# EAGLE design 25PinConnector (EAGLE 9.6.2)
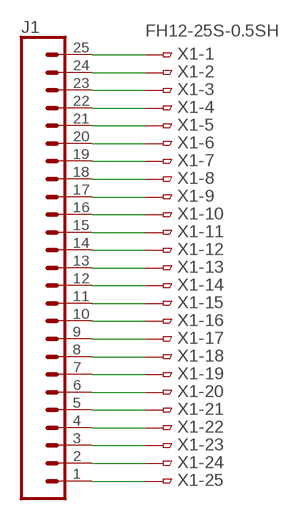
[diagram p0: schematic, sheet 1]

## Parts
J1  CONN_25  [1X25]
X1  FH12-25S-0.5SH  [FH12-25S-0.5SH]

## Nets
N$1: J1.25 X1.1
N$2: J1.24 X1.2
N$3: J1.23 X1.3
N$4: J1.22 X1.4
N$5: J1.21 X1.5
N$6: J1.20 X1.6
N$7: J1.19 X1.7
N$8: J1.18 X1.8
N$9: J1.17 X1.9
N$10: J1.16 X1.10
N$11: J1.15 X1.11
N$12: J1.14 X1.12
N$13: J1.13 X1.13
N$14: J1.12 X1.14
N$15: J1.11 X1.15
N$16: J1.10 X1.16
N$17: J1.9 X1.17
N$18: J1.8 X1.18
N$19: J1.7 X1.19
N$20: J1.6 X1.20
N$21: J1.5 X1.21
N$22: J1.4 X1.22
N$23: J1.3 X1.23
N$24: J1.2 X1.24
N$25: J1.1 X1.25

## Library data of the parts
J1 = SparkFun-Connectors:CONN_25: Multi connection point. Often used as Generic Header-pin footprint for 0.1 inch spaced/style header connections On any of the 0.1 inch spaced packages, you can populate with these: Break Away Headers - Straight <https://www.sparkfun.com/products/116> (PRT-00116) Break Away Male Headers - Right Angle <https://www.sparkfun.com/products/553> (PRT-00553) Female Headers <https://www.sparkfun.com/products/115> (PRT-00115) Break Away Headers - Machine Pin <https://www.sparkfun.com/products/117> (PRT-00117) Break Away Female Headers - Swiss Machine Pin <https://www.sparkfun.com/products/743> (PRT-00743) For SCREWTERMINALS and SPRING TERMINALS visit here: Screw Terimnals on SparkFun.com <https://www.sparkfun.com/search/results?term=Screw+Terminals> (5mm/3.5mm/2.54mm spacing) This device is also useful as a general connection point to wire up your design to another part of your project. Our various solder wires solder well into these plated through hole pads. Hook-Up Wire - Assortment (Stranded, 22 AWG) <https://www.sparkfun.com/products/11375> (PRT-11375) Hook-Up Wire - Assortment (Solid Core, 22 AWG) <https://www.sparkfun.com/products/11367> (PRT-11367) View the entire wire category on our website here <https://www.sparkfun.com/categories/141> Special notes: Molex polarized connector foot print use with SKU : PRT-08231 with associated crimp pins and housings. 1MM SMD Version SKU: PRT-10208 NOTES ON THE VARIANTS LOCK and LOCK_LONGPADS... This footprint was designed to help hold the alignment of a through-hole component (i.e. 6-pin header) while soldering it into place. You may notice that each hole has been shifted either up or down by 0.005 of an inch from it's more standard position (which is a perfectly straight line). This slight alteration caused the pins (the squares in the middle) to touch the edges of the holes. Because they are alternating, it causes a "brace" to hold the component in place. 0.005 has proven to be the perfect amount of "off-center" position when using our standard breakaway headers. Although looks a little odd when you look at the bare footprint, once you have a header in there, the alteration is very hard to notice. Also,if you push a header all the way into place, it is covered up entirely on the bottom side.
X1 = con-hirose:FH12-25S-0.5S: 0.5mm Pitch Connectors For FPC/FFC Source: Data sheet <http://www.hirose.co.jp/cataloge_hp/e58605370.pdf>; OC_FARNELL: unknown; OC_NEWARK: unknown

## Board
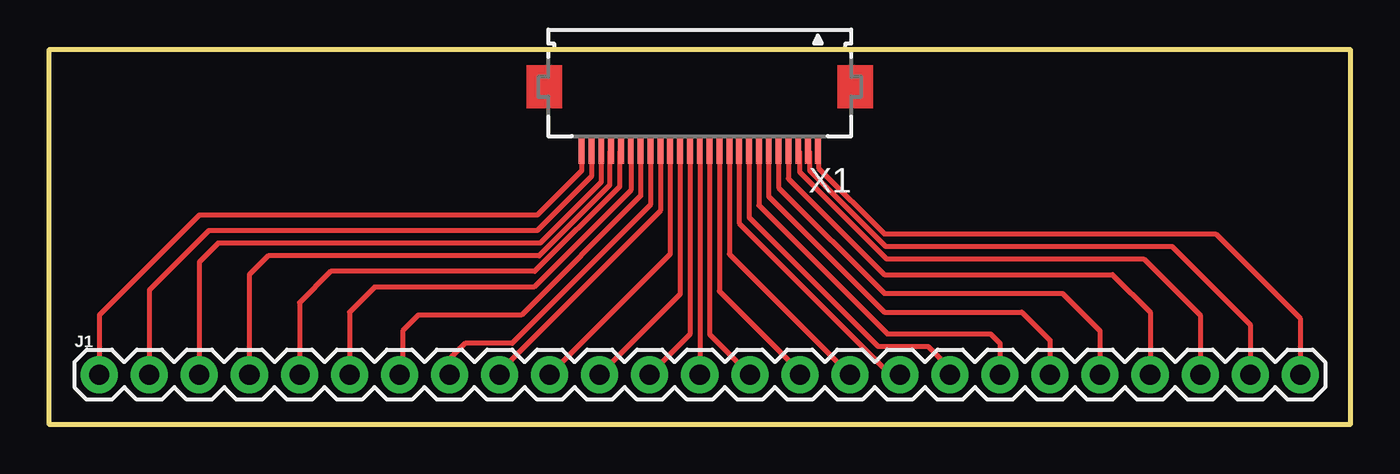
[diagram p1: board, top side]

Size 66.04 x 19.05 mm. Coordinates in mm from the lower left corner, seen from the top.
Outline: 0,0 0,19.05 66.04,19.05 66.04,0 0,0
Copper layers (1*16): Top 0.035mm / dielectric 1.5mm / Bottom 0.035mm
Design rules "default": minimum track width 6mil, minimum drill 0.35mm, track to track 6mil, track to pad 6mil, pad to pad 6mil, via to via 6mil, smd to smd 6mil, copper to edge 40mil, drill to drill 6mil, minimum pad ring 10mil, minimum via ring 8mil, stop-mask expansion 4mil, vias tented up to drill 0mil, thermal gap 10mil

### Footprints (pad centres in the part's own frame; a part is rotated, then mirrored left to right if it is on the bottom)
1X25 = drill 1.016 pad 1.88: 1 0,0; 2 2.54,0; 3 5.08,0; 4 7.62,0; 5 10.16,0; 6 12.7,0; 7 15.24,0; 8 17.78,0; 9 20.32,0; 10 22.86,0; 11 25.4,0; 12 27.94,0; 13 30.48,0; 14 33.02,0; 15 35.56,0; 16 38.1,0; 17 40.64,0; 18 43.18,0; 19 45.72,0; 20 48.26,0; 21 50.8,0; 22 53.34,0; 23 55.88,0; 24 58.42,0; 25 60.96,0
FH12-25S-0.5SH = smd 0.3 x 1.3: 1 -6,3.25; 2 -5.5,3.25; 3 -5,3.25; 4 -4.5,3.25; 5 -4,3.25; 6 -3.5,3.25; 7 -3,3.25; 8 -2.5,3.25; 9 -2,3.25; 10 -1.5,3.25; 11 -1,3.25; 12 -0.5,3.25; 13 0,3.25; 14 0.5,3.25; 15 1,3.25; 16 1.5,3.25; 17 2,3.25; 18 2.5,3.25; 19 3,3.25; 20 3.5,3.25; 21 4,3.25; 22 4.5,3.25; 23 5,3.25; 24 5.5,3.25; 25 6,3.25

### Placement (x,y rotation side)
J1  2.54,2.54 0 top
X1  33.02,17.14 180 top

### Tracks (layer width: path | path; a pad name or v marks a point on that pad's centre or on a via)
N$1
  Top 0.254: X1.1 39.05,13.86 39.05,13.02 42.39,9.68 59.21,9.68 63.5,5.4 J1.25
N$2
  Top 0.254: X1.2 38.59,13.82 38.59,12.9 42.45,9.05 56.99,9.05 60.96,5.08 J1.24
N$3
  Top 0.254: X1.3 38.09,13.82 38.09,12.83 42.51,8.41 55.56,8.41 58.42,5.56 J1.23
N$4
  Top 0.254: X1.4 37.52,12.49 42.39,7.62 53.98,7.62 55.88,5.71 J1.22
N$5
  Top 0.254: X1.5 37.02,12.03 42.39,6.67 51.44,6.67 53.34,4.76 J1.21
N$6
  Top 0.254: X1.6 36.52,11.58 42.39,5.71 49.37,5.71 50.8,4.29 J1.20
N$7
  Top 0.254: X1.7 36.02,11.13 42.55,4.6 47.78,4.6 48.26,4.13 J1.19
N$8
  Top 0.254: X1.8 35.52,10.52 42.07,3.97 44.61,3.97 45.72,2.86 J1.18
N$9
  Top 0.254: X1.9 35.02,10.22 42.7,2.54 J1.17
N$10
  Top 0.254: X1.10 34.52,8.66 J1.16
N$11
  Top 0.254: X1.11 34.02,6.78 38.1,2.7 J1.15
N$12
  Top 0.254: X1.12 33.52,4.58 J1.14
N$13
  Top 0.254: X1.13 J1.13
N$14
  Top 0.254: X1.14 32.52,4.58 J1.12
N$15
  Top 0.254: X1.15 32.02,6.62 J1.11
N$16
  Top 0.254: X1.16 31.52,8.66 J1.10
N$17
  Top 0.254: X1.17 31.02,10.86 22.86,2.7 J1.9
N$18
  Top 0.254: X1.18 30.52,11.15 23.5,4.13 21.11,4.13 20.32,3.33 J1.8
N$19
  Top 0.254: X1.19 30.02,11.61 23.97,5.56 18.73,5.56 17.94,4.76 17.94,2.7 J1.7
N$20
  Top 0.254: X1.20 29.52,11.9 24.61,6.99 16.51,6.99 15.24,5.71 J1.6
N$21
  Top 0.254: X1.21 28.95,13.82 28.95,12.08 24.64,7.78 14.29,7.78 12.7,6.19 J1.5
N$22
  Top 0.254: X1.22 28.45,13.82 28.45,12.16 24.86,8.57 11.11,8.57 10.16,7.62 J1.4
N$23
  Top 0.254: X1.23 28.02,12.3 24.92,9.21 8.57,9.21 7.62,8.26 J1.3
N$24
  Top 0.254: X1.24 27.52,12.6 24.77,9.84 8.1,9.84 5.08,6.83 J1.2
N$25
  Top 0.254: X1.25 27.02,12.89 24.77,10.64 7.62,10.64 2.54,5.56 J1.1